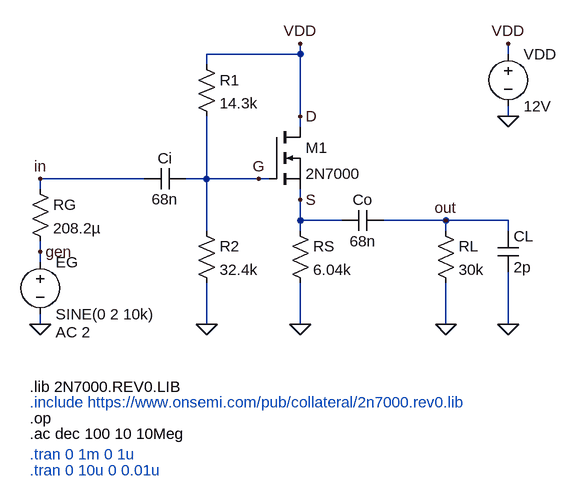
[diagram p0: schematic stage_4.asc]
stage_4.asc, the LTspice schematic file:
Version 4
SHEET 1 1412 784
WIRE 240 16 240 0
WIRE 240 16 96 16
WIRE 560 16 560 0
WIRE 96 32 96 16
WIRE 240 112 240 16
WIRE 560 112 560 96
WIRE 240 128 240 112
WIRE 0 208 -160 208
WIRE 96 208 96 112
WIRE 96 208 64 208
WIRE 176 208 96 208
WIRE 192 208 176 208
WIRE -160 224 -160 208
WIRE 240 240 240 224
WIRE 240 272 240 240
WIRE 304 272 240 272
WIRE 464 272 368 272
WIRE 560 272 464 272
WIRE 96 288 96 208
WIRE 240 288 240 272
WIRE 464 288 464 272
WIRE 560 288 560 272
WIRE -160 320 -160 304
WIRE -160 336 -160 320
WIRE -160 432 -160 416
WIRE 96 432 96 368
WIRE 240 432 240 368
WIRE 464 432 464 368
WIRE 560 432 560 352
FLAG 560 112 0
FLAG 560 0 VDD
FLAG 240 0 VDD
FLAG 96 432 0
FLAG 240 432 0
FLAG 464 432 0
FLAG 560 432 0
FLAG -160 432 0
FLAG -160 320 gen
FLAG -160 208 in
FLAG 464 272 out
FLAG 240 112 D
FLAG 176 208 G
FLAG 240 240 S
SYMBOL nmos 192 128 R0
SYMATTR InstName M1
SYMATTR Value 2N7000
SYMATTR Prefix X
SYMBOL voltage 560 0 R0
WINDOW 123 0 0 Left 0
WINDOW 39 0 0 Left 0
SYMATTR InstName VDD
SYMATTR Value 12V
SYMBOL res 224 272 R0
SYMATTR InstName RS
SYMATTR Value 6.04k
SYMBOL res 80 272 R0
SYMATTR InstName R2
SYMATTR Value 32.4k
SYMBOL res 80 16 R0
SYMATTR InstName R1
SYMATTR Value 14.3k
SYMBOL cap 64 192 R90
WINDOW 0 0 32 VBottom 2
WINDOW 3 32 32 VTop 2
SYMATTR InstName Ci
SYMATTR Value 68n
SYMBOL cap 368 256 R90
WINDOW 0 0 32 VBottom 2
WINDOW 3 32 32 VTop 2
SYMATTR InstName Co
SYMATTR Value 68n
SYMBOL res 448 272 R0
SYMATTR InstName RL
SYMATTR Value 30k
SYMBOL cap 544 288 R0
SYMATTR InstName CL
SYMATTR Value 2p
SYMBOL res -176 208 R0
SYMATTR InstName RG
SYMATTR Value 208.2µ
SYMBOL voltage -160 320 R0
WINDOW 123 24 124 Left 2
WINDOW 39 0 0 Left 0
SYMATTR InstName EG
SYMATTR Value SINE(0 2 10k)
SYMATTR Value2 AC 2
TEXT -176 528 Left 2 !.lib 2N7000.REV0.LIB
TEXT -176 552 Left 2 ;.include https://www.onsemi.com/pub/collateral/2n7000.rev0.lib
TEXT -176 576 Left 2 !.op
TEXT -176 632 Left 2 ;.tran 0 1m 0 1u
TEXT -176 656 Left 2 ;.tran 0 10u 0 0.01u
TEXT -176 600 Left 2 !.ac dec 100 10 10Meg

The netlist it stands for:
* stage_4.asc
XM1 D G S 2N7000  ; pins D G S
VDD D 0 12V
RS S 0 6.04k
R2 G 0 32.4k
R1 D G 14.3k
Ci G in 68n
Co out S 68n
RL out 0 30k
CL out 0 2p
RG in gen 208.2µ
V§EG gen 0 SINE(0 2 10k) AC 2
.lib 2N7000.REV0.LIB
* .include https://www.onsemi.com/pub/collateral/2n7000.rev0.lib
.op
* .tran 0 1m 0 1u
* .tran 0 10u 0 0.01u
.ac dec 100 10 10Meg
.backanno
.end